# Altium schematic sheet LDO.SchDoc
size 381 x 241 mm; SheetNumber: 8; SheetTotal: 12
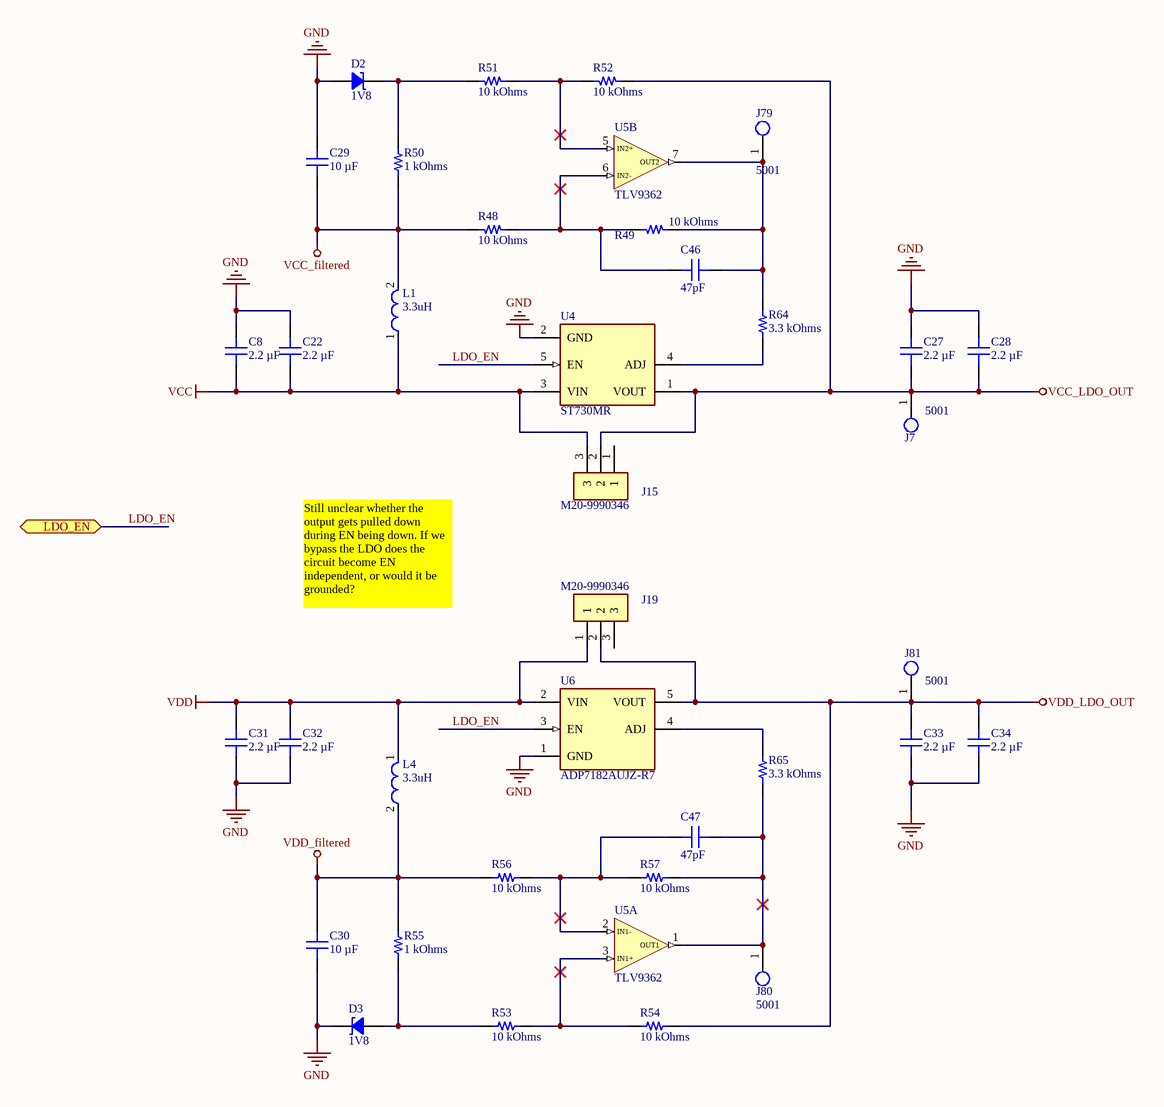
[diagram p0: LDO.SchDoc]

## Parts
C8  2.2 µF  [CAP 1206_3216 - 0.8MM]
C22  2.2 µF  [CAP 1206_3216 - 0.8MM]
C27  2.2 µF  [CAP 1206_3216 - 0.8MM]
C28  2.2 µF  [CAP 1206_3216 - 0.8MM]
C29  10 µF  [CAP 1206_3216 - 0.8MM]
C30  10 µF  [CAP 1206_3216 - 0.8MM]
C31  2.2 µF  [CAP 1206_3216 - 0.8MM]
C32  2.2 µF  [CAP 1206_3216 - 0.8MM]
C33  2.2 µF  [CAP 1206_3216 - 0.8MM]
C34  2.2 µF  [CAP 1206_3216 - 0.8MM]
C46  47pF  [CAP 1206_3216 - 1.8MM]
C47  47pF  [CAP 1206_3216 - 1.8MM]
D2  1V8  [SOD323]
D3  1V8  [SOD323]
J7  5001  [FP-5001-MFG]
J15  M20-9990346  [HDRV3W64P0X254_1X3_762X254X864P]
J19  M20-9990346  [HDRV3W64P0X254_1X3_762X254X864P]
J79  5001  [FP-5001-MFG]
J80  5001  [FP-5001-MFG]
J81  5001  [FP-5001-MFG]
L1  3.3uH  [FP-MLZ2012-1_25-IPC_B]
L4  3.3uH  [FP-MLZ2012-1_25-IPC_B]
R48  10 kOhms  [YAGEO RES 1206_3216]
R49  10 kOhms  [YAGEO RES 1206_3216]
R50  1 kOhms  [YAGEO RES 1206_3216]
R51  10 kOhms  [YAGEO RES 1206_3216]
R52  10 kOhms  [YAGEO RES 1206_3216]
R53  10 kOhms  [YAGEO RES 1206_3216]
R54  10 kOhms  [YAGEO RES 1206_3216]
R55  1 kOhms  [YAGEO RES 1206_3216]
R56  10 kOhms  [YAGEO RES 1206_3216]
R57  10 kOhms  [YAGEO RES 1206_3216]
R64  3.3 kOhms  [YAGEO RES 1206_3216]
R65  3.3 kOhms  [YAGEO RES 1206_3216]
U4  ST730MR  [FP-UJ-5-IPC_B]
U5  TLV9362  [SOIC8-127P600X175-8N]  (parts A,B of 3)
U6  ADP7182AUJZ-R7  [FP-UJ-5-IPC_B]

## Ports
LDO_EN (bidir, see MCU[4B], power[3D])

## Nets
GND: C8.1 C22.1 C27.1 C28.1 C29.1 C30.1 C31.1 C32.1 C33.1 C34.1 D2.1 D3.2 U4.2(GND) U6.1(GND)
VCC: C8.2 C22.2 J15.3 L1.1 U4.3(VIN)
VCC_filtered: C29.2 L1.2 R48.2 R50.1
VCC_LDO_OUT: C27.2 C28.2 J7.1 J15.2 R52.1 U4.1(VOUT)
VDD: C31.2 C32.2 J19.1 L4.1 U6.2(VIN)
VDD_filtered: C30.2 L4.2 R55.2 R56.2
VDD_LDO_OUT: C33.2 C34.2 J19.2 J81.1 R54.1 U6.5(VOUT)
LDO_EN: U4.5(EN) U6.3(EN) ; port LDO_EN
NetC46_1: C46.1 R48.1 R49.2 U5.6(IN2-)
NetC46_2: C46.2 J79.1 R49.1 R64.1 U5.7(OUT2)
NetC47_1: C47.1 R56.1 R57.2 U5.2(IN1-)
NetC47_2: C47.2 J80.1 R57.1 R65.2 U5.1(OUT1)
NetD2_2: D2.2 R50.2 R51.2
NetD3_1: D3.1 R53.2 R55.1
NetR51_1: R51.1 R52.2 U5.5(IN2+)
NetR53_1: R53.1 R54.2 U5.3(IN1+)
NetR64_2: R64.2 U4.4(ADJ)
NetR65_1: R65.1 U6.4(ADJ)

Not connected (* = marked no-connect by the designer): J15 1; J19 3

## Notes on the sheet
- Still unclear whether the output gets pulled down during EN being down. If we bypass the LDO does the circuit become EN independent, or would it be grounded?
- Type @ to refer to a designator or a net

## Library data of the parts
C8 C22 C27 C28 C31-C34 = 885382208001: CAP CER 2.2UF 25V X7R 1206; manufacturer: Würth Elektronik; Tolerance: ±10%; Part Number: 885382208001; Capacitance: 2.2 µF; Applications: Boardflex Sensitive; componentlink2description: DigiKey Link; componentlink2url: https://www.digikey.com/en/products/detail/würth-elektronik/885382208001/9816354; Device Package: 1206 (3216 Metric); Features: Soft Termination; lastupdated: 6/4/2024 19:10:38; Lifecycle Status: Active; Minimum Order: 1; Mounting Type: Surface Mount, MLCC; Operating Temperature: -55°C ~ 125°C; Package / Case: 1206 (3216 Metric); packaging: TapeAndReel; partid: 45904; Part Status: Active; price: 0.35; series: WCAP-CSST; Size / Dimension: 0.126" L x 0.063" W (3.20mm x 1.60mm); Supplier 1: DigiKey; Supplier Part Number 1: 732-13199-1-ND; Temperature Coefficient: X7R; Thickness (Max): 0.083" (2.10mm); value: 2.2 µF; Voltage - Rated: 25V
C29 C30 = 885012208069: CAP CER 10UF 25V X7R 1206; manufacturer: Würth Elektronik; Tolerance: ±10%; Part Number: 885012208069; Capacitance: 10 µF; Applications: General Purpose; componentlink1description: Datasheet; componentlink1url: https://katalog.we-online.de/pbs/datasheet/885012208069.pdf; componentlink2description: DigiKey Link; componentlink2url: https://www.digikey.com/en/products/detail/würth-elektronik/885012208069/5453429; Device Package: 1206 (3216 Metric); lastupdated: 6/4/2024 19:10:32; Lifecycle Status: Active; Minimum Order: 1; Mounting Type: Surface Mount, MLCC; Operating Temperature: -55°C ~ 125°C; Package / Case: 1206 (3216 Metric); packaging: TapeAndReel; partid: 43199; Part Status: Active; price: 0.40; series: WCAP-CSGP; Size / Dimension: 0.126" L x 0.063" W (3.20mm x 1.60mm); Supplier 1: DigiKey; Supplier Part Number 1: 732-7574-1-ND; Temperature Coefficient: X7R; Thickness (Max): 0.075" (1.90mm); value: 10 µF; Voltage - Rated: 25V
C46 C47 = 1206AA470KAT1A: CAP CER 47PF 1KV C0G/NP0 1206; manufacturer: AVX Corporation; Temperature Coefficient: C0G, NP0; Tolerance: ±10%; Voltage - Rated: 1000V (1kV); Part Number: 1206AA470KAT1A; Capacitance: 47pF; Applications: General Purpose; componentlink1description: Datasheet; componentlink1url: http://datasheets.avx.com/AVX-HV_MLCC.pdf; componentlink2description: DigiKey Link; componentlink2url: http://digikey.com/product-detail/en/avx-corporation/1206AA470KAT1A/478-2949-1-ND/808148; Device Package: 1206 (3216 Metric); Features: High Voltage; lastupdated: 9/2/2020 01:05:31; Lifecycle Status: Active; Minimum Order: 1; Mounting Type: Surface Mount, MLCC; Operating Temperature: -55°C ~ 125°C; Package / Case: 1206 (3216 Metric); packaging: TapeAndReel; partid: 21825; Part Status: Active; price: 0.11; series: -; Size / Dimension: 0.130" L x 0.063" W (3.30mm x 1.60mm); Supplier 1: DigiKey; Supplier Part Number 1: 478-2949-1-ND; Thickness (Max): 0.071" (1.80mm); value: 47pF
D2 D3 = BZX38450-C1V8X
J7 J79-J81 = CMP-2000-05181-2: PC TEST POINT MINIATURE BLACK; Body Material: Bronze; Plating: Silver; Inside Diameter: 1.27mm; Hole Diameter: 1.6mm; Number of Ports: 1; Outside Diameter: 2.54mm; Insulation: Insulated; Insulation Material: Nylon; Mount: Through Hole; RoHS Compliant: Yes; Series: THM; Height: 0.3inch; Termination: Through Hole; Material: Nylon; Packaging: Bulk; Contact Material: Bronze; REACH SVHC: No SVHC; Contact Plating: Silver; Orientation: Straight; Lead Free: Lead Free; Package Quantity: 100; Length: 7.62mm; Flammability Rating: UL94 V-0; Number of Contacts: 1; Diameter: 2.54mm; Housing Color: Black; Color: Black
J15 J19 = M20-9990346: Connector; Manufacturer_Name: Harwin; Datasheet Link: https://cdn.harwin.com/pdfs/M20-999.pdf; Height: 8.64mm; Manufacturer_Part_Number: M20-9990346; Mouser Part Number: 855-M20-9990346; Mouser Price/Stock: https://www.mouser.co.uk/ProductDetail/Harwin/M20-9990346?qs=ulE8k0yEMYbyhQ3uXpFs8Q%3D%3D
L1 L4 = MLZ2012M: Shielded Multilayer Inductor 3.3uH ±20% 500mA 260mΩ SMD 0805; Saturation Current: 350mA; Core Material: Ferrite; DC Resistance (DCR): 260mR; RoHS Compliant: Yes; Mount: Surface Mount; Case Code (Metric): 2012; Case/Package: 0805; Min Operating Temperature: -55°C; Package Quantity: 2000; Shielding: Shielded; Current Rating: 500mA; Height - Seated (Max): 0.057inch; Case Code (Imperial): 0805; Width: 0.049inch; Tolerance: 20%; Packaging: Tape and Reel; Inductance: 3.3uH; Lead Free: Lead Free; Max Operating Temperature: 125°C; Length: 0.079inch; Value: 3.3uH
R48 R49 R51-R54 R56 R57 = RT1206FRE0710KL: RES SMD 10K OHM 1% 1/4W 1206; Manufacturer: Yageo; Power (Watts): 0.25W, 1/4W; Temperature Coefficient: ±50ppm/°C; Part Number: RT1206FRE0710KL; ComponentLink1Description: Datasheet; ComponentLink1URL: https://www.yageo.com/upload/media/product/productsearch/datasheet/rchip/PYu-RT_1-to-0.01_RoHS_L_11.pdf; ComponentLink2Description: DigiKey Link; ComponentLink2URL: https://www.digikey.com/en/products/detail/yageo/RT1206FRE0710KL/1082868; Composition: Thin Film; Device Package: 1206 (3216 Metric); Height - Seated (Max): 0.026" (0.65mm); LastUpdated: 7/25/2024 09:21:28; Lifecycle Status: Active; Minimum Order: 1; Number of Terminations: 2; Operating Temperature: -55°C ~ 155°C; Package / Case: 1206 (3216 Metric); Packaging: TapeAndReel; PartId: 38903; Part Status: Active; Price: 0.01; Resistance: 10 kOhms; Series: RT; Size / Dimension: 0.122" L x 0.063" W (3.10mm x 1.60mm); Supplier 1: DigiKey; Supplier Part Number 1: YAG1242CT-ND; Supplier Device Package: 1206; Tolerance: ±1%; Value: 10 kOhms
R50 R55 = RT1206FRE071KL: RES SMD 1K OHM 1% 1/4W 1206; Manufacturer: Yageo; Power (Watts): 0.25W, 1/4W; Temperature Coefficient: ±50ppm/°C; Part Number: RT1206FRE071KL; ComponentLink1Description: Datasheet; ComponentLink1URL: https://www.yageo.com/upload/media/product/productsearch/datasheet/rchip/PYu-RT_1-to-0.01_RoHS_L_11.pdf; ComponentLink2Description: DigiKey Link; ComponentLink2URL: https://www.digikey.com/en/products/detail/yageo/RT1206FRE071KL/1083016; Composition: Thin Film; Device Package: 1206 (3216 Metric); Height - Seated (Max): 0.026" (0.65mm); LastUpdated: 7/25/2024 09:21:27; Lifecycle Status: Active; Minimum Order: 1; Number of Terminations: 2; Operating Temperature: -55°C ~ 155°C; Package / Case: 1206 (3216 Metric); Packaging: TapeAndReel; PartId: 40465; Part Status: Active; Price: 0.01; Resistance: 1 kOhms; Series: RT; Size / Dimension: 0.122" L x 0.063" W (3.10mm x 1.60mm); Supplier 1: DigiKey; Supplier Part Number 1: YAG3366CT-ND; Supplier Device Package: 1206; Tolerance: ±1%; Value: 1 kOhms
R64 R65 = RT1206FRE073K3L: RES SMD 3.3K OHM 1% 1/4W 1206; Manufacturer: Yageo; Power (Watts): 0.25W, 1/4W; Temperature Coefficient: ±50ppm/°C; Part Number: RT1206FRE073K3L; ComponentLink1Description: Datasheet; ComponentLink1URL: https://www.yageo.com/upload/media/product/productsearch/datasheet/rchip/PYu-RT_1-to-0.01_RoHS_L_12.pdf; ComponentLink2Description: DigiKey Link; ComponentLink2URL: https://www.digikey.com/en/products/detail/yageo/RT1206FRE073K3L/1083187; Composition: Thin Film; Device Package: 1206 (3216 Metric); Height - Seated (Max): 0.026" (0.65mm); LastUpdated: 7/25/2024 09:21:22; Lifecycle Status: Active; Minimum Order: 1; Number of Terminations: 2; Operating Temperature: -55°C ~ 155°C; Package / Case: 1206 (3216 Metric); Packaging: TapeAndReel; PartId: 58380; Price: 0.01; Resistance: 3.3 kOhms; Series: RT; Size / Dimension: 0.122" L x 0.063" W (3.10mm x 1.60mm); Supplier 1: DigiKey; Supplier Part Number 1: 13-RT1206FRE073K3LCT-ND; Supplier Device Package: 1206; Tolerance: ±1%; Value: 3.3 kOhms; Part Status: Active
U5 = TLV9362: TLV936x 10-MHz, 40-V, RRO, Operational Amplifie; ComponentLink1Description: Datasheet; ComponentLink1URL: https://www.ti.com/lit/ds/symlink/tlv9362.pdf
U6 = ADP7182: IC REG LIN NEG ADJ 200MA 5TSOT; Manufacturer: Analog Devices; Number Of Outputs: 1; Min Supply Voltage: -2.7V; Max Junction Temp: +125°C; Dropout Voltage: -185mV; Output Current: -200mA; Max Supply Voltage: -28V; Output Voltage: -1.22/-27.815V; Nominal Supply Current: -33/-650uA; Output Type: AdjustableProgrammable; Accuracy Percentage: 1%; RoHS: TRUE; Ambient Temperature Range Low: -40°C; Digikey Description: IC REG LIN NEG ADJ 200MA 5TSOT; Device Class L3: Voltage Regulators - Linear; Ambient Temperature Range High: +85°C; Manufacturer Part Number: ADP7182AUJZ-R7; ComponentLink2URL: https://www.analog.com/media/en/technical-documentation/data-sheets/ADP7182.pdf; Ipc Land Pattern Name: SOT95P280X100-5; Temperature Range Low: -40°C; ComponentLink2Description: Datasheet; Mouser Description: LDO Regulator Neg -1.22V to -27V 0.2A 5-Pin TSOT T/R; Category: IC; Automotive: No; Device Class L1: Integrated Circuits (ICs); Temperature: -40°C to +125°C; Octopart: https://octopart.com/adp7182aujz-r7-analog+devices-21054665; Device Class L2: Power Management ICs; Height: 1mm; Package: UJ-5; Temperature Range High: +125°C; Lead Free: Yes